# Altium schematic sheet Sensors.SchDoc: Sensor Array Connections
size 203 x 203 mm; DrawnBy: Kace Chandler; DocumentNumber: 2; SheetNumber: 2; SheetTotal: 23
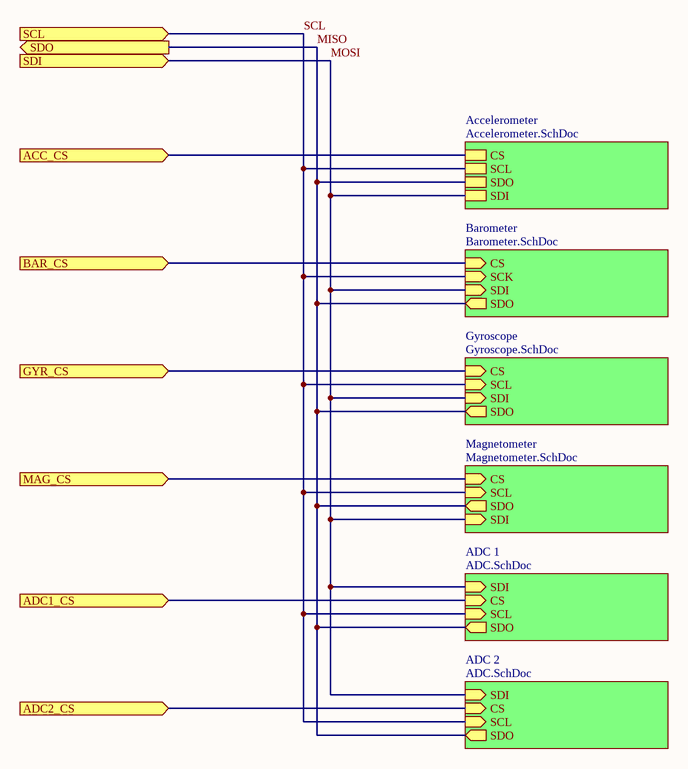
[diagram p0: Sensors.SchDoc]

## Sub-sheets
Accelerometer = Accelerometer.SchDoc: CS, SCL, SDO, SDI
ADC 1 = ADC.SchDoc: SDI (in), CS (in), SCL (in), SDO (out)
ADC 2 = ADC.SchDoc: SDI (in), CS (in), SCL (in), SDO (out)
Barometer = Barometer.SchDoc: CS (in), SCK (in), SDI (in), SDO (out)
Gyroscope = Gyroscope.SchDoc: CS (in), SCL (in), SDI (in), SDO (out)
Magnetometer = Magnetometer.SchDoc: CS (in), SCL (in), SDO (out), SDI (in)

## Ports
ACC_CS (in), ADC1_CS (in), ADC2_CS (in), BAR_CS (in), GYR_CS (in), MAG_CS (in), SCL (in), SDI (in), SDO (out)

## Nets
ACC_CS: port ACC_CS, sheet Accelerometer/CS
ADC1_CS: port ADC1_CS, sheet ADC 1/CS
ADC2_CS: port ADC2_CS, sheet ADC 2/CS
BAR_CS: port BAR_CS, sheet Barometer/CS
GYR_CS: port GYR_CS, sheet Gyroscope/CS
MAG_CS: port MAG_CS, sheet Magnetometer/CS
MISO: port SDO, sheet Accelerometer/SDO, sheet Barometer/SDO, sheet Gyroscope/SDO, sheet Magnetometer/SDO, sheet ADC 1/SDO, sheet ADC 2/SDO
MOSI: port SDI, sheet Accelerometer/SDI, sheet Barometer/SDI, sheet Gyroscope/SDI, sheet Magnetometer/SDI, sheet ADC 1/SDI, sheet ADC 2/SDI
SCL: port SCL, sheet Accelerometer/SCL, sheet Barometer/SCK, sheet Gyroscope/SCL, sheet Magnetometer/SCL, sheet ADC 1/SCL, sheet ADC 2/SCL